# Altium schematic sheet EDGE_PCI_EXPRESS_X8.SchDoc: PCI Express X8 Edge Connector
size A4
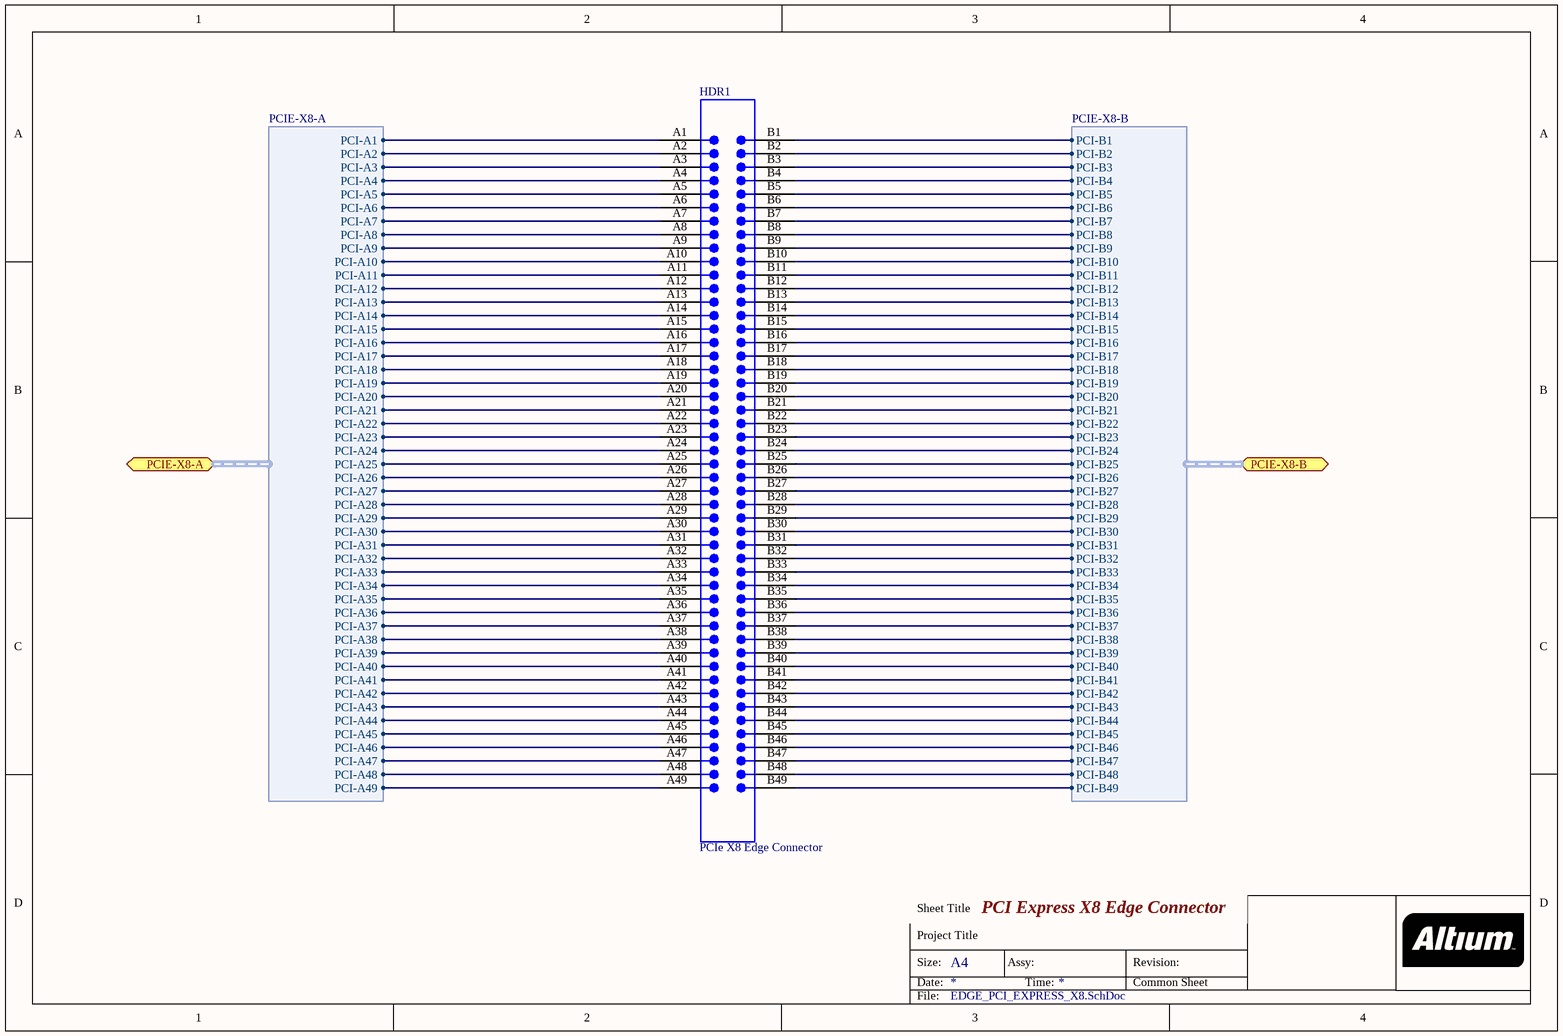
[diagram p0: EDGE_PCI_EXPRESS_X8.SchDoc]

## Parts
HDR1  PCIe X8 Edge Connector  [EDGE-PCIE-X8]

## Ports
PCIE-X8-A (harness PCIE-X8-A), PCIE-X8-B (harness PCIE-X8-B)

## Harnesses
PCIE-X8-A: PCI-A1, PCI-A2, PCI-A3, PCI-A4, PCI-A5, PCI-A6, PCI-A7, PCI-A8, PCI-A9, PCI-A10, PCI-A11, PCI-A12, PCI-A13, PCI-A14, PCI-A15, PCI-A16, PCI-A17, PCI-A18, PCI-A19, PCI-A20, PCI-A21, PCI-A22, PCI-A23, PCI-A24, PCI-A25, PCI-A26, PCI-A27, PCI-A28, PCI-A29, PCI-A30, PCI-A31, PCI-A32, PCI-A33, PCI-A34, PCI-A35, PCI-A36, PCI-A37, PCI-A38, PCI-A39, PCI-A40, PCI-A41, PCI-A42, PCI-A43, PCI-A44, PCI-A45, PCI-A46, PCI-A47, PCI-A48, PCI-A49
PCIE-X8-B: PCI-B1, PCI-B2, PCI-B3, PCI-B4, PCI-B5, PCI-B6, PCI-B7, PCI-B8, PCI-B9, PCI-B10, PCI-B11, PCI-B12, PCI-B13, PCI-B14, PCI-B15, PCI-B16, PCI-B17, PCI-B18, PCI-B19, PCI-B20, PCI-B21, PCI-B22, PCI-B23, PCI-B24, PCI-B25, PCI-B26, PCI-B27, PCI-B28, PCI-B29, PCI-B30, PCI-B31, PCI-B32, PCI-B33, PCI-B34, PCI-B35, PCI-B36, PCI-B37, PCI-B38, PCI-B39, PCI-B40, PCI-B41, PCI-B42, PCI-B43, PCI-B44, PCI-B45, PCI-B46, PCI-B47, PCI-B48, PCI-B49

## Nets
NetHDR1_A1: HDR1.A1 ; port PCIE-X8-A.PCI-A1
NetHDR1_A2: HDR1.A2 ; port PCIE-X8-A.PCI-A2
NetHDR1_A3: HDR1.A3 ; port PCIE-X8-A.PCI-A3
NetHDR1_A4: HDR1.A4 ; port PCIE-X8-A.PCI-A4
NetHDR1_A5: HDR1.A5 ; port PCIE-X8-A.PCI-A5
NetHDR1_A6: HDR1.A6 ; port PCIE-X8-A.PCI-A6
NetHDR1_A7: HDR1.A7 ; port PCIE-X8-A.PCI-A7
NetHDR1_A8: HDR1.A8 ; port PCIE-X8-A.PCI-A8
NetHDR1_A9: HDR1.A9 ; port PCIE-X8-A.PCI-A9
NetHDR1_A10: HDR1.A10 ; port PCIE-X8-A.PCI-A10
NetHDR1_A11: HDR1.A11 ; port PCIE-X8-A.PCI-A11
NetHDR1_A12: HDR1.A12 ; port PCIE-X8-A.PCI-A12
NetHDR1_A13: HDR1.A13 ; port PCIE-X8-A.PCI-A13
NetHDR1_A14: HDR1.A14 ; port PCIE-X8-A.PCI-A14
NetHDR1_A15: HDR1.A15 ; port PCIE-X8-A.PCI-A15
NetHDR1_A16: HDR1.A16 ; port PCIE-X8-A.PCI-A16
NetHDR1_A17: HDR1.A17 ; port PCIE-X8-A.PCI-A17
NetHDR1_A18: HDR1.A18 ; port PCIE-X8-A.PCI-A18
NetHDR1_A19: HDR1.A19 ; port PCIE-X8-A.PCI-A19
NetHDR1_A20: HDR1.A20 ; port PCIE-X8-A.PCI-A20
NetHDR1_A21: HDR1.A21 ; port PCIE-X8-A.PCI-A21
NetHDR1_A22: HDR1.A22 ; port PCIE-X8-A.PCI-A22
NetHDR1_A23: HDR1.A23 ; port PCIE-X8-A.PCI-A23
NetHDR1_A24: HDR1.A24 ; port PCIE-X8-A.PCI-A24
NetHDR1_A25: HDR1.A25 ; port PCIE-X8-A.PCI-A25
NetHDR1_A26: HDR1.A26 ; port PCIE-X8-A.PCI-A26
NetHDR1_A27: HDR1.A27 ; port PCIE-X8-A.PCI-A27
NetHDR1_A28: HDR1.A28 ; port PCIE-X8-A.PCI-A28
NetHDR1_A29: HDR1.A29 ; port PCIE-X8-A.PCI-A29
NetHDR1_A30: HDR1.A30 ; port PCIE-X8-A.PCI-A30
NetHDR1_A31: HDR1.A31 ; port PCIE-X8-A.PCI-A31
NetHDR1_A32: HDR1.A32 ; port PCIE-X8-A.PCI-A32
NetHDR1_A33: HDR1.A33 ; port PCIE-X8-A.PCI-A33
NetHDR1_A34: HDR1.A34 ; port PCIE-X8-A.PCI-A34
NetHDR1_A35: HDR1.A35 ; port PCIE-X8-A.PCI-A35
NetHDR1_A36: HDR1.A36 ; port PCIE-X8-A.PCI-A36
NetHDR1_A37: HDR1.A37 ; port PCIE-X8-A.PCI-A37
NetHDR1_A38: HDR1.A38 ; port PCIE-X8-A.PCI-A38
NetHDR1_A39: HDR1.A39 ; port PCIE-X8-A.PCI-A39
NetHDR1_A40: HDR1.A40 ; port PCIE-X8-A.PCI-A40
NetHDR1_A41: HDR1.A41 ; port PCIE-X8-A.PCI-A41
NetHDR1_A42: HDR1.A42 ; port PCIE-X8-A.PCI-A42
NetHDR1_A43: HDR1.A43 ; port PCIE-X8-A.PCI-A43
NetHDR1_A44: HDR1.A44 ; port PCIE-X8-A.PCI-A44
NetHDR1_A45: HDR1.A45 ; port PCIE-X8-A.PCI-A45
NetHDR1_A46: HDR1.A46 ; port PCIE-X8-A.PCI-A46
NetHDR1_A47: HDR1.A47 ; port PCIE-X8-A.PCI-A47
NetHDR1_A48: HDR1.A48 ; port PCIE-X8-A.PCI-A48
NetHDR1_A49: HDR1.A49 ; port PCIE-X8-A.PCI-A49
NetHDR1_B1: HDR1.B1 ; port PCIE-X8-B.PCI-B1
NetHDR1_B2: HDR1.B2 ; port PCIE-X8-B.PCI-B2
NetHDR1_B3: HDR1.B3 ; port PCIE-X8-B.PCI-B3
NetHDR1_B4: HDR1.B4 ; port PCIE-X8-B.PCI-B4
NetHDR1_B5: HDR1.B5 ; port PCIE-X8-B.PCI-B5
NetHDR1_B6: HDR1.B6 ; port PCIE-X8-B.PCI-B6
NetHDR1_B7: HDR1.B7 ; port PCIE-X8-B.PCI-B7
NetHDR1_B8: HDR1.B8 ; port PCIE-X8-B.PCI-B8
NetHDR1_B9: HDR1.B9 ; port PCIE-X8-B.PCI-B9
NetHDR1_B10: HDR1.B10 ; port PCIE-X8-B.PCI-B10
NetHDR1_B11: HDR1.B11 ; port PCIE-X8-B.PCI-B11
NetHDR1_B12: HDR1.B12 ; port PCIE-X8-B.PCI-B12
NetHDR1_B13: HDR1.B13 ; port PCIE-X8-B.PCI-B13
NetHDR1_B14: HDR1.B14 ; port PCIE-X8-B.PCI-B14
NetHDR1_B15: HDR1.B15 ; port PCIE-X8-B.PCI-B15
NetHDR1_B16: HDR1.B16 ; port PCIE-X8-B.PCI-B16
NetHDR1_B17: HDR1.B17 ; port PCIE-X8-B.PCI-B17
NetHDR1_B18: HDR1.B18 ; port PCIE-X8-B.PCI-B18
NetHDR1_B19: HDR1.B19 ; port PCIE-X8-B.PCI-B19
NetHDR1_B20: HDR1.B20 ; port PCIE-X8-B.PCI-B20
NetHDR1_B21: HDR1.B21 ; port PCIE-X8-B.PCI-B21
NetHDR1_B22: HDR1.B22 ; port PCIE-X8-B.PCI-B22
NetHDR1_B23: HDR1.B23 ; port PCIE-X8-B.PCI-B23
NetHDR1_B24: HDR1.B24 ; port PCIE-X8-B.PCI-B24
NetHDR1_B25: HDR1.B25 ; port PCIE-X8-B.PCI-B25
NetHDR1_B26: HDR1.B26 ; port PCIE-X8-B.PCI-B26
NetHDR1_B27: HDR1.B27 ; port PCIE-X8-B.PCI-B27
NetHDR1_B28: HDR1.B28 ; port PCIE-X8-B.PCI-B28
NetHDR1_B29: HDR1.B29 ; port PCIE-X8-B.PCI-B29
NetHDR1_B30: HDR1.B30 ; port PCIE-X8-B.PCI-B30
NetHDR1_B31: HDR1.B31 ; port PCIE-X8-B.PCI-B31
NetHDR1_B32: HDR1.B32 ; port PCIE-X8-B.PCI-B32
NetHDR1_B33: HDR1.B33 ; port PCIE-X8-B.PCI-B33
NetHDR1_B34: HDR1.B34 ; port PCIE-X8-B.PCI-B34
NetHDR1_B35: HDR1.B35 ; port PCIE-X8-B.PCI-B35
NetHDR1_B36: HDR1.B36 ; port PCIE-X8-B.PCI-B36
NetHDR1_B37: HDR1.B37 ; port PCIE-X8-B.PCI-B37
NetHDR1_B38: HDR1.B38 ; port PCIE-X8-B.PCI-B38
NetHDR1_B39: HDR1.B39 ; port PCIE-X8-B.PCI-B39
NetHDR1_B40: HDR1.B40 ; port PCIE-X8-B.PCI-B40
NetHDR1_B41: HDR1.B41 ; port PCIE-X8-B.PCI-B41
NetHDR1_B42: HDR1.B42 ; port PCIE-X8-B.PCI-B42
NetHDR1_B43: HDR1.B43 ; port PCIE-X8-B.PCI-B43
NetHDR1_B44: HDR1.B44 ; port PCIE-X8-B.PCI-B44
NetHDR1_B45: HDR1.B45 ; port PCIE-X8-B.PCI-B45
NetHDR1_B46: HDR1.B46 ; port PCIE-X8-B.PCI-B46
NetHDR1_B47: HDR1.B47 ; port PCIE-X8-B.PCI-B47
NetHDR1_B48: HDR1.B48 ; port PCIE-X8-B.PCI-B48
NetHDR1_B49: HDR1.B49 ; port PCIE-X8-B.PCI-B49

## Notes on the sheet
- Sheet Title
- Project Title
- Size:
- Date:
- A4
- Assy:
- Time:
- Revision:
- Common Sheet
- File:

## Library data of the parts
HDR1 = D-300-0115: Connector, PCI Express; Connector type: Straight; Max Current: 1.1/pin A; Mounting Technology: Surface Mount; Pin Count: 98; Status: Unreleased; Category: Connector